# EAGLE design uno_shield_generic_1 (EAGLE 7.5.0)
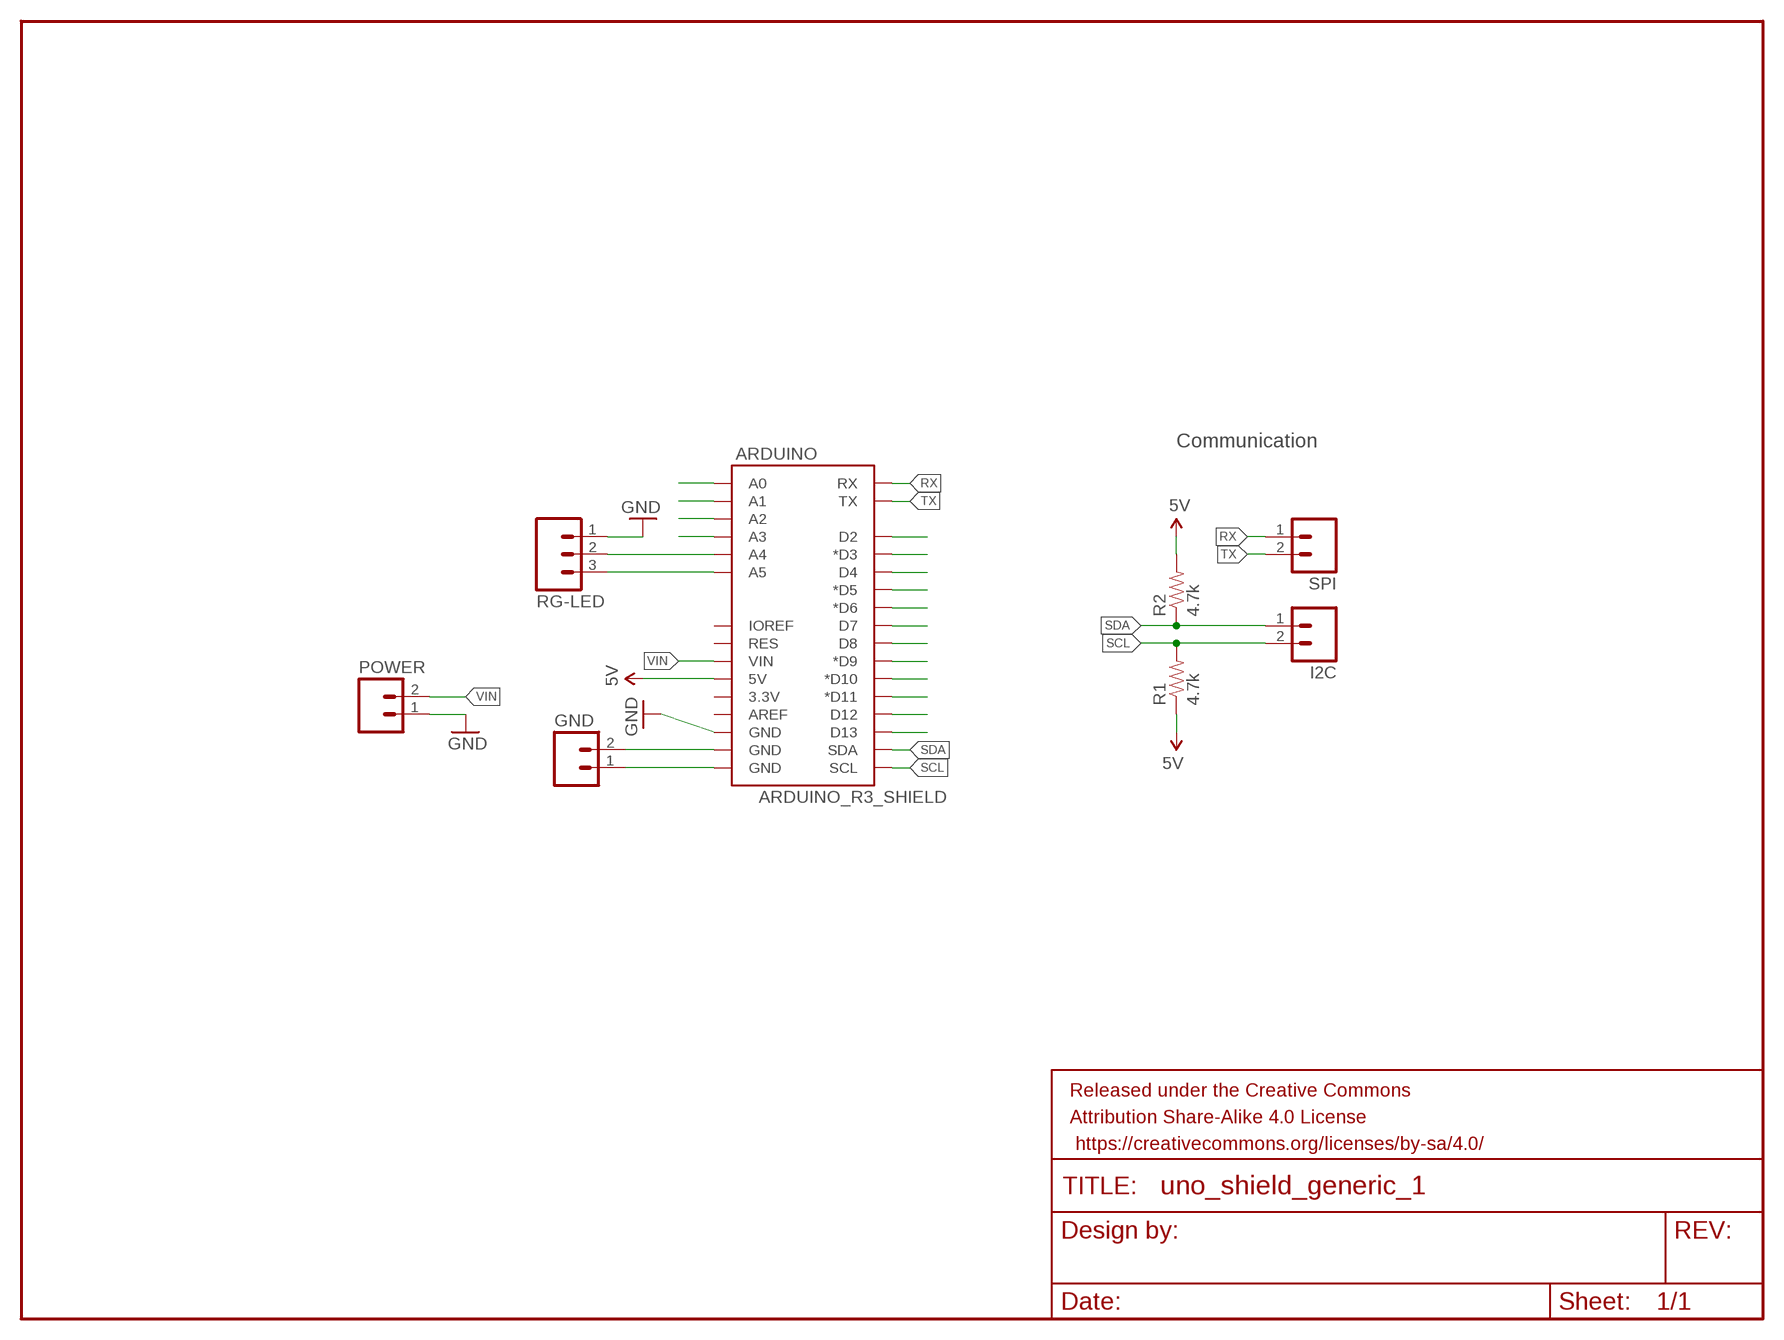
[diagram p0: schematic, sheet 1]

## Parts
ARDUINO  ARDUINO_R3_SHIELD  [UNO_R3_SHIELD]
FRAME1  FRAME-LETTER  [CREATIVE_COMMONS]
GND  M02LOCK_LONGPADS  [1X02_LOCK_LONGPADS]
I2C  M02LOCK_LONGPADS  [1X02_LOCK_LONGPADS]
POWER  M02LOCK_LONGPADS  [1X02_LOCK_LONGPADS]
R1  4.7k  RESISTORKIT  [AXIAL-0.3-KIT]
R2  4.7k  RESISTORKIT  [AXIAL-0.3-KIT]
RG-LED  M03LONGPADS  [1X03_LONGPADS]
SPI  M02LOCK_LONGPADS  [1X02_LOCK_LONGPADS]

## Nets
5V: ARDUINO.5V R1.P$1 R2.P$2
GND: ARDUINO.GND@2(GND) POWER.1 RG-LED.1
N$1: ARDUINO.D2
N$2: ARDUINO.D3(*D3)
N$3: ARDUINO.D4
N$4: ARDUINO.D5(*D5)
N$5: ARDUINO.D6(*D6)
N$6: ARDUINO.D7
N$7: ARDUINO.D8
N$8: ARDUINO.D9(*D9)
N$9: ARDUINO.D10(*D10)
N$10: ARDUINO.D11(*D11)
N$11: ARDUINO.D12
N$12: ARDUINO.D13
N$17: ARDUINO.A4 RG-LED.2
N$18: ARDUINO.A5 RG-LED.3
N$21: ARDUINO.GND@1(GND) GND.2
N$22: ARDUINO.GND@0(GND) GND.1
N$27: ARDUINO.A3
N$28: ARDUINO.A2
N$29: ARDUINO.A1
N$30: ARDUINO.A0
RX: ARDUINO.RX SPI.1
SCL: ARDUINO.SCL I2C.2 R1.P$2
SDA: ARDUINO.SDA I2C.1 R2.P$1
TX: ARDUINO.TX SPI.2
VIN: ARDUINO.VIN POWER.2
Unconnected: ARDUINO.3.3V ARDUINO.AREF ARDUINO.IOREF ARDUINO.RES

## Notes on the sheet
- Communication

## Library data of the parts
ARDUINO = Nathans-Arduinos:ARDUINO_R3_SHIELD: Shield form compatible with the Arduino Uno R3.
FRAME1 = SparkFun-Aesthetics:FRAME-LETTER: Schematic Frame Standard 8.5x11 US Letter frame
GND I2C POWER SPI = SparkFun-Connectors:M02: Standard 2-pin 0.1" header. Use with - straight break away headers ( PRT-00116) - right angle break away headers (PRT-00553) - swiss pins (PRT-00743) - machine pins (PRT-00117) - female headers (PRT-00115) Molex polarized connector foot print use with: PRT-08233 with associated crimp pins and housings. 2.54_SCREWTERM for use with PRT-10571. 3.5mm Screw Terminal footprints for PRT-08084 5mm Screw Terminal footprints for use with PRT-08432
R1 R2 = SparkFun-Resistors:RESISTOR: Resistor Basic schematic elements and footprints for 0603, 1206, and PTH resistors.
RG-LED = SparkFun-Connectors:M03: Header 3 Standard 3-pin 0.1" header. Use with straight break away headers (SKU : PRT-00116), right angle break away headers (PRT-00553), swiss pins (PRT-00743), machine pins (PRT-00117), and female headers (PRT-00115). Molex polarized connector foot print use with SKU : PRT-08232 with associated crimp pins and housings.

## Board
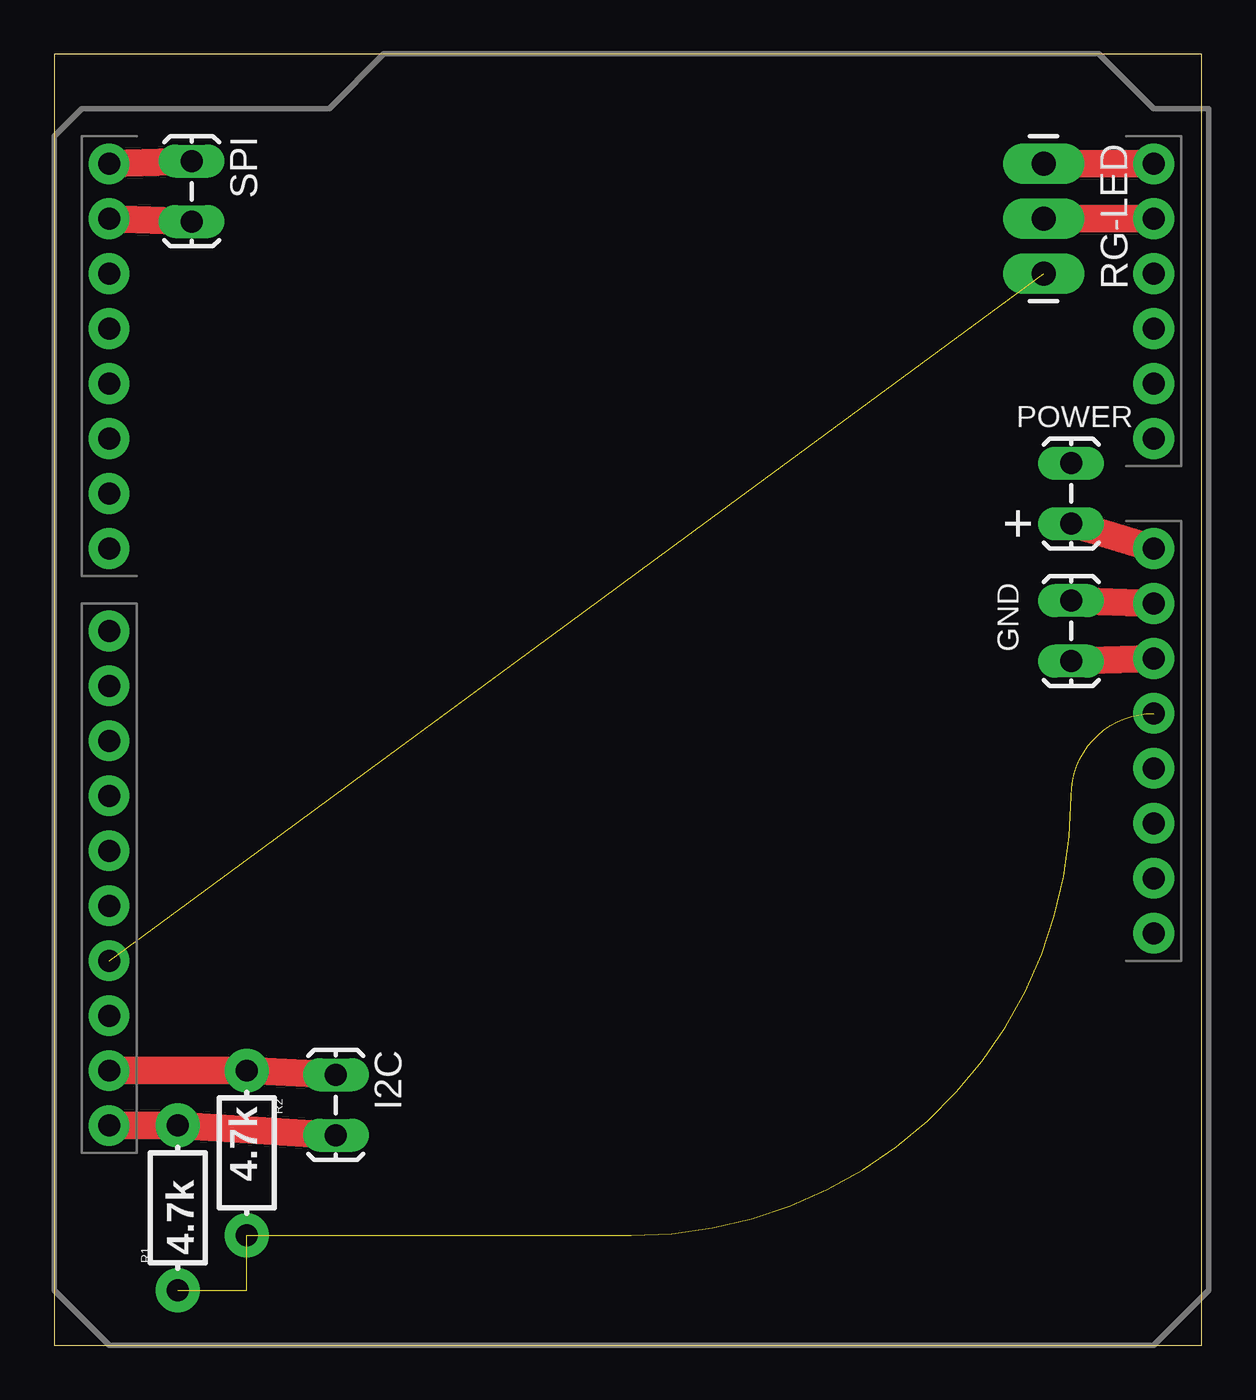
[diagram p1: board, top side]
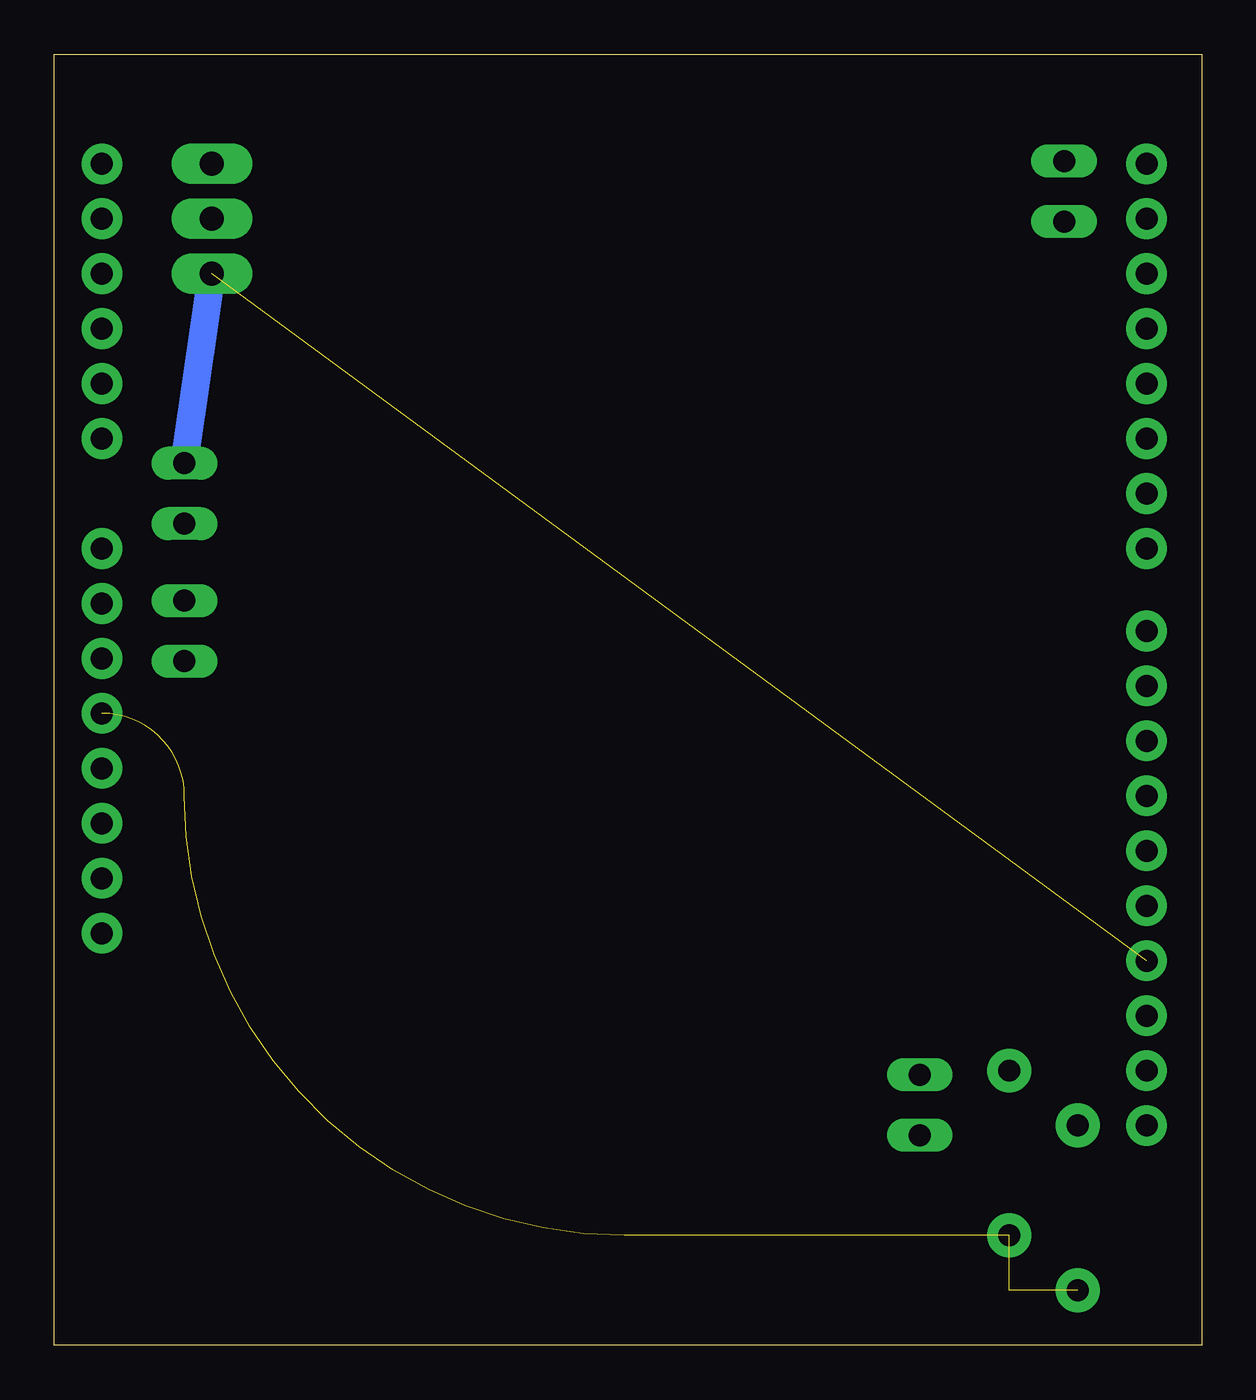
[diagram p2: board, bottom side, seen from below]

Size 53.01 x 59.68 mm. Coordinates in mm from the lower left corner, seen from the top.
Outline: 0,0 53.01,0 53.01,59.68 0,59.68 0,0
Copper layers (1*16): Top 0.035mm / dielectric 1.5mm / Bottom 0.035mm
Design rules "default": minimum track width 10mil, minimum drill 24mil, track to track 8mil, track to pad 8mil, pad to pad 8mil, via to via 8mil, smd to smd 8mil, copper to edge 40mil, drill to drill 8mil, minimum pad ring 10mil, minimum via ring 8mil, stop-mask expansion 4mil, vias tented up to drill 0mil, thermal gap 10mil

### Footprints (pad centres in the part's own frame; a part is rotated, then mirrored left to right if it is on the bottom)
UNO_R3_SHIELD = drill 1.016 pad 1.88: 3.3V 50.8,26.67; 5V 50.8,29.21; A0 50.8,41.91; A1 50.8,44.45; A2 50.8,46.99; A3 50.8,49.53; A4 50.8,52.07; A5 50.8,54.61; AREF 2.54,15.24; D2 2.54,49.53; D3 2.54,46.99; D4 2.54,44.45; D5 2.54,41.91; D6 2.54,39.37; D7 2.54,36.83; D8 2.54,33.02; D9 2.54,30.48; D10 2.54,27.94; D11 2.54,25.4; D12 2.54,22.86; D13 2.54,20.32; GND@0 50.8,31.75; GND@1 50.8,34.29; GND@2 2.54,17.78; IOREF 50.8,21.59; NC 50.8,19.05; RES 50.8,24.13; RX 2.54,54.61; SCL 2.54,10.16; SDA 2.54,12.7; TX 2.54,52.07; VIN 50.8,36.83
1X02_LOCK_LONGPADS = drill 1.016 long: 1 -0.127,0; 2 2.667,0
AXIAL-0.3-KIT = drill 1.016 pad 2.032: P$1 -3.81,0; P$2 3.81,0
1X03_LONGPADS = drill 1.118 pad 1.88 long: 1 0,0; 2 2.54,0; 3 5.08,0

### Placement (x,y rotation side)
ARDUINO  0,0 0 top
FRAME1  20.32,-8.89 0 top  (outside the outline)
GND  46.99,31.75 90 top
I2C  13.02,12.38 270 top
POWER  46.99,40.64 270 top
R1  5.71,6.35 90 top
R2  8.89,8.89 270 top
RG-LED  45.72,49.53 90 top
SPI  6.35,54.61 270 top

### Tracks (layer width: path | path; a pad name or v marks a point on that pad's centre or on a via)
5V  (5 unrouted)
GND  (1 unrouted)
  Bottom 1.27: RG-LED.1 POWER.1
N$17
  Top 1.27: ARDUINO.A4 RG-LED.2
N$18
  Top 1.27: ARDUINO.A5 RG-LED.3
N$21
  Top 1.27: ARDUINO.GND@1 GND.2
N$22
  Top 1.27: ARDUINO.GND@0 GND.1
RX
  Top 1.27: ARDUINO.RX SPI.1
SCL
  Top 1.27: ARDUINO.SCL R1.P$2 I2C.2
SDA
  Top 1.27: ARDUINO.SDA R2.P$1 I2C.1
TX
  Top 1.27: ARDUINO.TX SPI.2
VIN
  Top 1.27: ARDUINO.VIN POWER.2

### Text on the board
tNames: +